# EAGLE schematic Nusbio.smd (EAGLE 7.5.0)
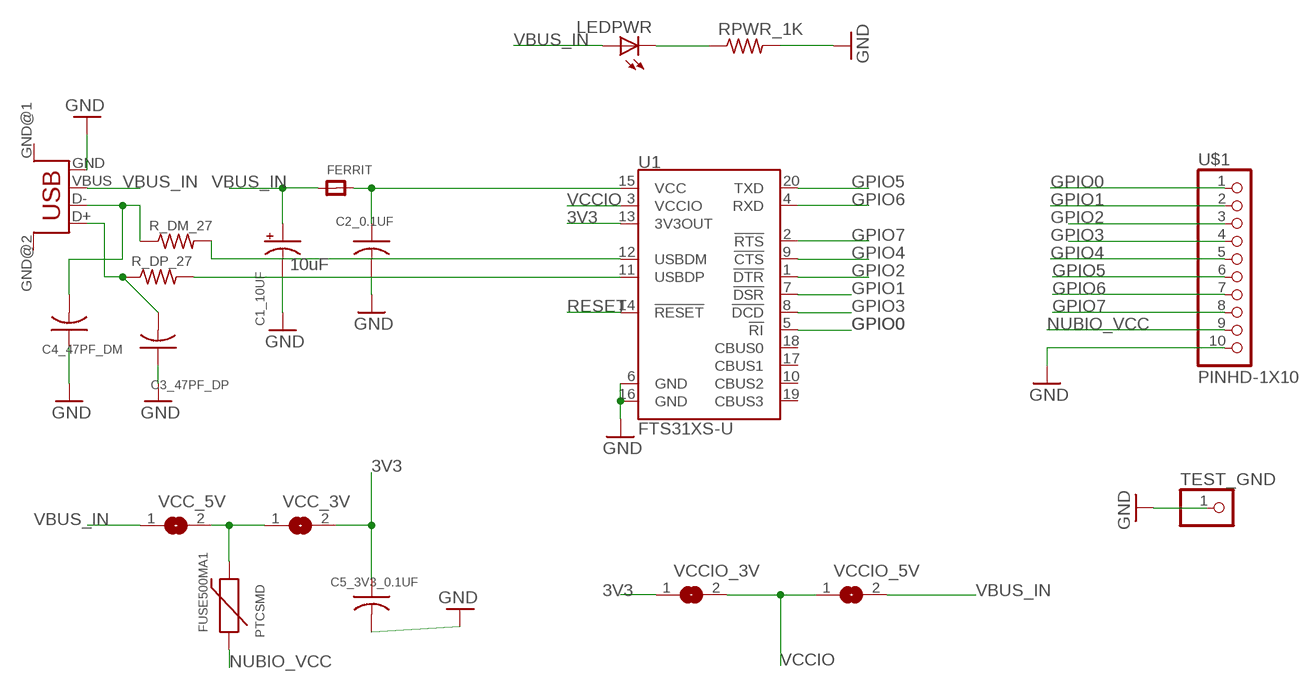
[diagram p0: schematic, sheet 1]

## Parts
C1_10UF  10uF  10UF-16V-10%(TANT)  [EIA3216]
C2_0.1UF  C-USC1206  [C1206]
C3_47PF_DP  C-USC1206  [C1206]
C4_47PF_DM  C-USC1206  [C1206]
C5_3V3_0.1UF  C-USC1206  [C1206]
FERRIT  FERRITE_0805  [_0805]
FUSE500MA1  PTCSMD  [PTC-1206]
LEDPWR  LEDCHIPLED_0805  [CHIPLED_0805]
R_DM_27  R-US_R0805  [R0805]
R_DP_27  R-US_R0805  [R0805]
RPWR_1K  R-US_R0805  [R0805]
TEST_GND  PINHD-1X1  [1X01]
U1  FTS31XS-U  FT231XS  [SSOP20_L]
U$1  PINHD-1X10  [1X10-BIG]
USB_FEMALE  USB  [USB-FEMALE-A-PTH]
VCC_3V  SOLDERJUMPERREFLOW  [SOLDERJUMPER_REFLOW]
VCC_5V  SOLDERJUMPERREFLOW  [SOLDERJUMPER_REFLOW]
VCCIO_3V  SOLDERJUMPERREFLOW  [SOLDERJUMPER_REFLOW]
VCCIO_5V  SOLDERJUMPERREFLOW  [SOLDERJUMPER_REFLOW]

## Nets
3V3: C5_3V3_0.1UF.1 U1.13(3V3OUT) VCC_3V.2 VCCIO_3V.1
GND: C1_10UF.C(-) C2_0.1UF.2 C3_47PF_DP.1 C4_47PF_DM.1 C5_3V3_0.1UF.2 RPWR_1K.2 TEST_GND.1 U1.6(GND) U1.16(GND) U$1.10 USB_FEMALE.GND
GPIO0: U1.5(!RI) U$1.1
GPIO1: U1.7(!DSR) U$1.2
GPIO2: U1.1(!DTR) U$1.3
GPIO3: U1.8(!DCD) U$1.4
GPIO4: U1.9(!CTS) U$1.5
GPIO5: U1.20(TXD) U$1.6
GPIO6: U1.4(RXD) U$1.7
GPIO7: U1.2(!RTS) U$1.8
N$3: LEDPWR.C RPWR_1K.1
N$4: R_DM_27.2 U1.12(USBDM)
N$5: R_DP_27.2 U1.11(USBDP)
N$14: C2_0.1UF.1 FERRIT.2 U1.15(VCC)
N$15: C3_47PF_DP.2 R_DP_27.1 USB_FEMALE.D+
N$16: C4_47PF_DM.2 R_DM_27.1 USB_FEMALE.D-
N$17: FUSE500MA1.2 VCC_3V.1 VCC_5V.2
NUBIO_VCC: FUSE500MA1.1 U$1.9
RESET: U1.14(!RESET)
VBUS_IN: C1_10UF.A(+) FERRIT.1 LEDPWR.A USB_FEMALE.VBUS VCC_5V.1 VCCIO_5V.2
VCCIO: U1.3(VCCIO) VCCIO_3V.2 VCCIO_5V.1
Unconnected: U1.10(CBUS2) U1.17(CBUS1) U1.18(CBUS0) U1.19(CBUS3) USB_FEMALE.GND@1(GND) USB_FEMALE.GND@2(GND)

## Library data of the parts
C1_10UF = SparkFun-Capacitors:10UF-16V-10%(TANT): CAP-00811 1206/EIA-3216 Tantalum capacitor; PROD_ID: CAP-00811
C2_0.1UF C3_47PF_DP C4_47PF_DM C5_3V3_0.1UF = adafruit:C-US: CAPACITOR, American symbol
FERRIT = microbuilder:FERRITE: Ferrite Bead 0603 MMZ1608B121C - 120 Ohm @ 100MHz, 600mA, 0.15 Ohm DC Resistance - Digikey: 445-2164-1-ND BK1608HW121-T - 120 Ohm, 600mA Ferrite Chip - Digikey: 587-1876-2-ND 0805 HZ0805B272R-10 - 2.7K Ohm @ 100MHz, 200mA, 0.8 Ohm DC Resistance - Digikey: 240-2504-1-ND (see also Murata BLM21BD272SN1L) MMZ2012Y152B - 1.5K Ohm @ 100MHz, 500mA, 0.4 Ohm DC Resistance - Digikey: 445-1560-1-ND - Mainly for high frequency (80-400MHz) MMZ2012R102A - 1K Ohm @ 100MHz, 500mA, 0.3 Ohm DC Resistance - Digikey: 445-1555-2-ND - More general purpose (10-200MHz)
FUSE500MA1 = SparkFun-PowerIC:PTC: Resettable Fuse PTC Resettable Fuse. Spark Fun Electronics SKU : COM-08357; PROD_ID: RES-11150
LEDPWR = adafruit:LED: LED OSRAM: - CHIPLED LG R971, LG N971, LY N971, LG Q971, LY Q971, LO R971, LY R971 LH N974, LH R974 LS Q976, LO Q976, LY Q976 LO Q996 - Hyper CHIPLED LW Q18S LB Q993, LB Q99A, LB R99A - SideLED LS A670, LO A670, LY A670, LG A670, LP A670 LB A673, LV A673, LT A673, LW A673 LH A674 LY A675 LS A676, LA A676, LO A676, LY A676, LW A676 LS A679, LY A679, LG A679 - Hyper Micro SIDELED® LS Y876, LA Y876, LO Y876, LY Y876 LT Y87S - SmartLED LW L88C, LW L88S LB L89C, LB L89S, LG L890 LS L89K, LO L89K, LY L89K LS L896, LA L896, LO L896, LY L896 - TOPLED LS T670, LO T670, LY T670, LG T670, LP T670 LSG T670, LSP T670, LSY T670, LOP T670, LYG T670 LG T671, LOG T671, LSG T671 LB T673, LV T673, LT T673, LW T673 LH T674 LS T676, LA T676, LO T676, LY T676, LB T676, LH T676, LSB T676, LW T676 LB T67C, LV T67C, LT T67C, LS T67K, LO T67K, LY T67K, LW E67C LS E67B, LA E67B, LO E67B, LY E67B, LB E67C, LV E67C, LT E67C LW T67C LS T679, LY T679, LG T679 LS T770, LO T770, LY T770, LG T770, LP T770 LB T773, LV T773, LT T773, LW T773 LH T774 LS E675, LA E675, LY E675, LS T675 LS T776, LA T776, LO T776, LY T776, LB T776 LHGB T686 LT T68C, LB T68C - Hyper Mini TOPLED® LB M676 - Mini TOPLED Santana® LG M470 LS M47K, LO M47K, LY M47K Source: http://www.osram.convergy.de/
R_DM_27 R_DP_27 RPWR_1K = adafruit:R-US_: RESISTOR, American symbol
TEST_GND = adafruit:PINHD-1X1: Pin header 1x1 for 0.1" spacing With round pins
U1 = SparkFun-DigitalIC:FT231X: FTDI FT231X Full Speed USB to Full-handshake UART This USB2.0 Full Speed IC offers a compact bridge to full handshake UART interfaces. The device is a UART, capable of operating up to 3MBaud, with low power consumption (8mA). The FT231X includes the complete FT-X series feature set and enables USB to be added into a system design quickly and easily over a UART interface.; PROD_ID: IC-11524
U$1 = adafruit:PINHD-1X10: Pin header 1x10 0.1" spacing With round pins
USB_FEMALE = STUNTAZ:USB: USB Connectors USB-FEMALE-A-PTH: Through hole Female Type A Connector
VCC_3V VCC_5V VCCIO_3V VCCIO_5V = microbuilder:SOLDERJUMPER: SMD Solder JUMPER Solder the two pads together to create a connection, or remove the solder to break it. REFLOW - Use this footprint for solder paste and reflow ovens. WAVE - Use this footprint for hand-soldering (larger pads). CLOSED - Has a trace between the two pads to ensure it is closed by default. The trace needs to be cut to disable the jumper, and can be closed again by creating a solder bridge between the two pads.